# EAGLE design power distribution board (EAGLE 7.6.0)
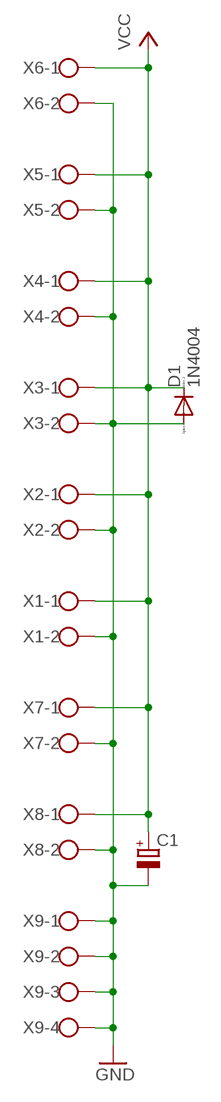
[diagram p0: schematic, sheet 1]

## Parts
C1  CPOL-EUE5-10.5  [E5-10,5]
D1  1N4004  [DO41-10]
X1  W237-102  [W237-102]
X2  W237-102  [W237-102]
X3  W237-102  [W237-102]
X4  W237-102  [W237-102]
X5  W237-102  [W237-102]
X6  W237-102  [W237-102]
X7  W237-102  [W237-102]
X8  W237-102  [W237-102]
X9  W237-4  [W237-4]

## Nets
GND: C1.- D1.A X1.2 X2.2 X3.2 X4.2 X5.2 X6.2 X7.2 X8.2 X9.1 X9.2 X9.3 X9.4
VCC: C1.+ D1.C X1.1 X2.1 X3.1 X4.1 X5.1 X6.1 X7.1 X8.1

## Library data of the parts
C1 = rcl:CPOL-EU: POLARIZED CAPACITOR, European symbol
D1 = diode:1N4004: DIODE general purpose rectifier, 1 A
X1-X8 = con-wago-500:W237-102: WAGO SCREW CLAMP; MPN: 237-102; OC_FARNELL: unknown; OC_NEWARK: 70K9898
X9 = con-wago-500:W237-4: WAGO SCREW CLAMP; OC_FARNELL: unknown; OC_NEWARK: unknown

## Board
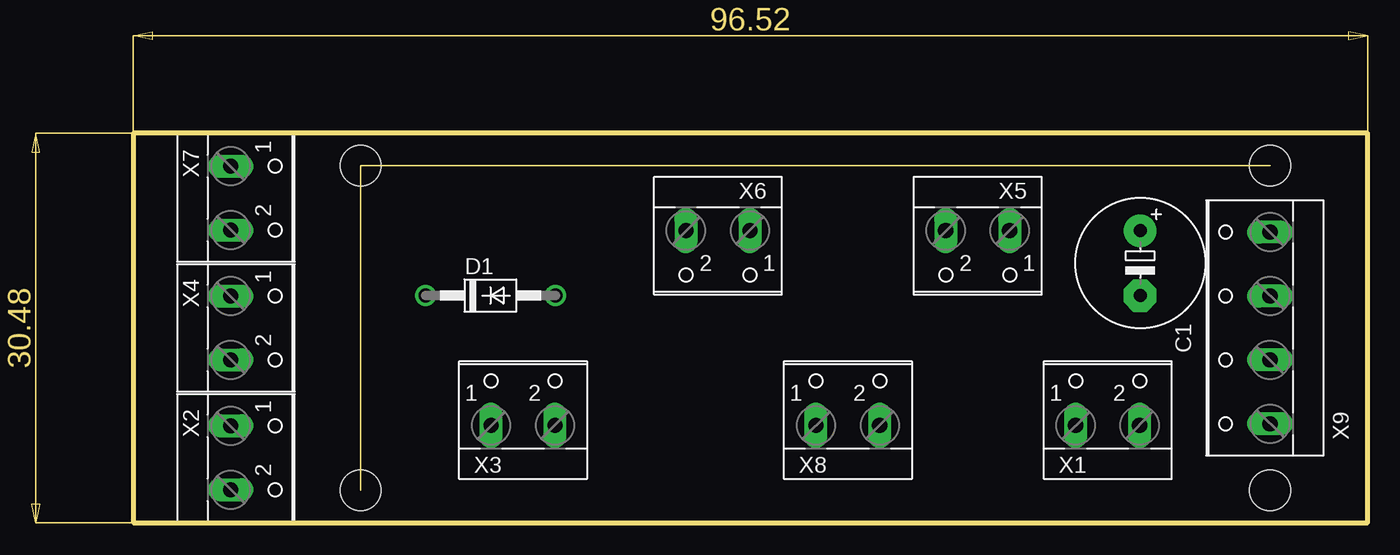
[diagram p1: board, top side]
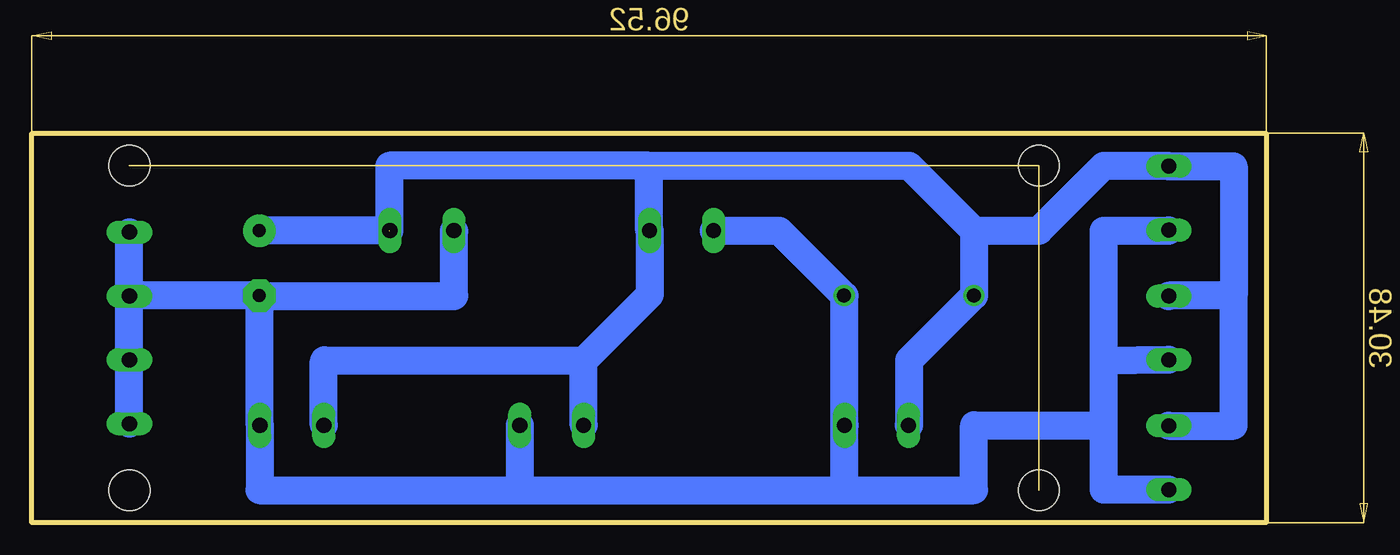
[diagram p2: board, bottom side, seen from below]

Size 96.52 x 30.48 mm. Coordinates in mm from the lower left corner, seen from the top.
Outline: 0,0 96.52,0 96.52,30.48 0,30.48 0,0
Copper layers (1*16): Top 0.035mm / dielectric 1.5mm / Bottom 0.035mm
Design rules "default": minimum track width 10mil, minimum drill 24mil, track to track 8mil, track to pad 8mil, pad to pad 8mil, via to via 8mil, smd to smd 8mil, copper to edge 40mil, drill to drill 8mil, minimum pad ring 10mil, minimum via ring 8mil, stop-mask expansion 4mil, vias tented up to drill 0mil, thermal gap 10mil
Holes 3.2 mm at 17.78,2.54 88.9,2.54 17.78,27.94 88.9,27.94

### Footprints (pad centres in the part's own frame; a part is rotated, then mirrored left to right if it is on the bottom)
E5-10,5 = drill 1.016 pad 2.54: + -2.54,0 | drill 1.016 pad 2.54 octagon: - 2.54,0
DO41-10 = drill 1.118: A 5.08,0; C -5.08,0
W237-102 = drill 1.194 long: 1 -2.5,-1.27; 2 2.5,-1.27
W237-4 = drill 1.194 long: 1 -7.5,-1.27; 2 -2.5,-1.27; 3 2.5,-1.27; 4 7.5,-1.27

### Placement (x,y rotation side)
C1  78.74,20.32 270 top
D1  27.94,17.78 0 top
X1  76.2,8.89 0 top
X2  8.89,5.08 270 top
X3  30.48,8.89 0 top
X4  8.89,15.24 270 top
X5  66.04,21.59 180 top
X6  45.72,21.59 180 top
X7  8.89,25.4 270 top
X8  55.88,8.89 0 top
X9  87.63,15.24 90 top

### Tracks (layer width: path | path; a pad name or v marks a point on that pad's centre or on a via)
GND
  Bottom 2.184: X2.2 12.7,2.58 12.7,7.62 | 12.7,7.62 12.7,12.66 | 12.7,12.66 12.7,22.86 7.62,22.86 X7.2 | X4.2 12.7,12.66 | 33.02,2.54 33.02,7.62 X3.2 32.98,17.78 D1.A 38.1,22.86 X6.2 | 33.02,2.54 22.86,2.54 22.86,7.62 12.7,7.62 | X8.2 58.38,2.58 58.42,2.54 | 58.42,2.54 33.02,2.54 | 58.42,2.54 78.74,2.54 78.7,2.58 X1.2 78.7,17.74 | 78.7,17.74 C1.- 88.9,17.78 | 88.9,17.78 X9.4 | X9.1 X9.2 X9.3 88.9,17.78 | 78.7,17.74 63.54,17.74 63.5,17.78 63.5,22.82 X5.2
VCC  (1 unrouted)
  Bottom 2.184: 2.54,17.78 2.54,27.9 X7.1 7.66,27.94 12.7,27.94 17.78,22.86 22.86,22.86 | 2.54,17.78 7.62,17.78 X4.1 | X2.1 2.54,7.58 2.54,17.78 | X3.1 27.94,7.62 27.94,12.7 D1.C 22.86,22.86 | 48.26,27.94 27.94,27.94 22.86,22.86 | 48.26,27.94 48.26,22.86 X6.1 48.22,17.82 53.34,12.7 | 48.26,27.94 68.58,27.94 68.58,22.86 C1.+ | X1.1 73.7,12.66 73.66,12.7 53.34,12.7 | X8.1 53.38,12.66 53.34,12.7